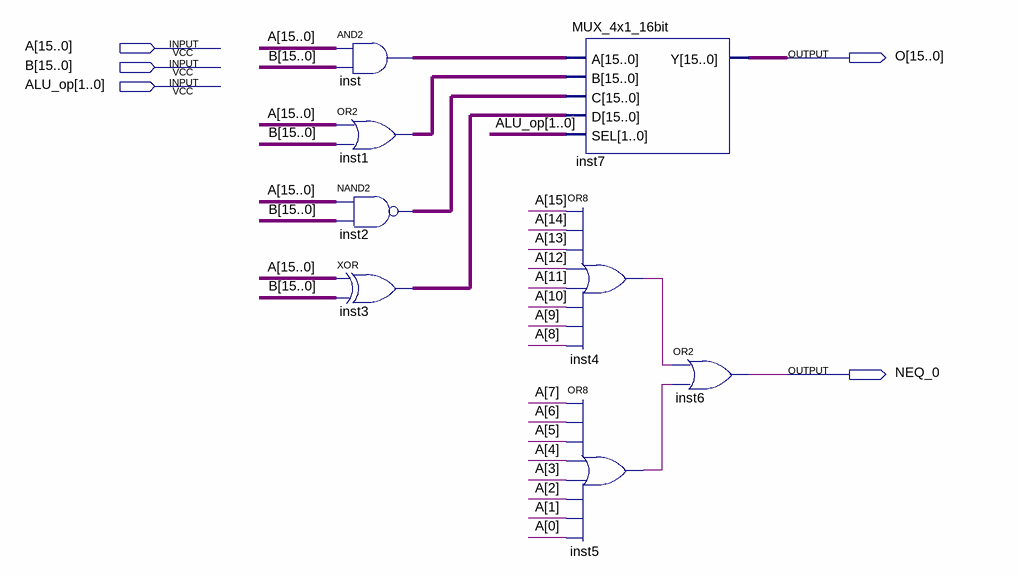
[diagram p0: schematic sheet]
// Quartus schematic LU.bdf as structural Verilog: 8 symbols, 5 pins
module LU (
  input  [15:0] A,
  input  [15:0] B,
  input  [1:0] ALU_op,
  output [15:0] O,
  output NEQ_0
);

  wire inst4_out, inst5_out;
  wire [15:0] inst1_out, inst2_out, inst3_out, inst_out;

  assign inst_out = A & B;  // AND2 inst, 16 bits wide
  assign inst1_out = A | B;  // OR2 inst1, 16 bits wide
  assign inst2_out = ~(A & B);  // NAND2 inst2, 16 bits wide
  assign inst3_out = A ^ B;  // XOR inst3, 16 bits wide
  MUX_4x1_16bit inst7 (.A(inst_out), .B(inst1_out), .C(inst2_out), .D(inst3_out), .SEL(ALU_op), .Y(O));
  or inst4 (inst4_out, A[15], A[14], A[13], A[12], A[11], A[10], A[9], A[8]);
  or inst5 (inst5_out, A[7], A[6], A[5], A[4], A[3], A[2], A[1], A[0]);
  or inst6 (NEQ_0, inst4_out, inst5_out);
endmodule
